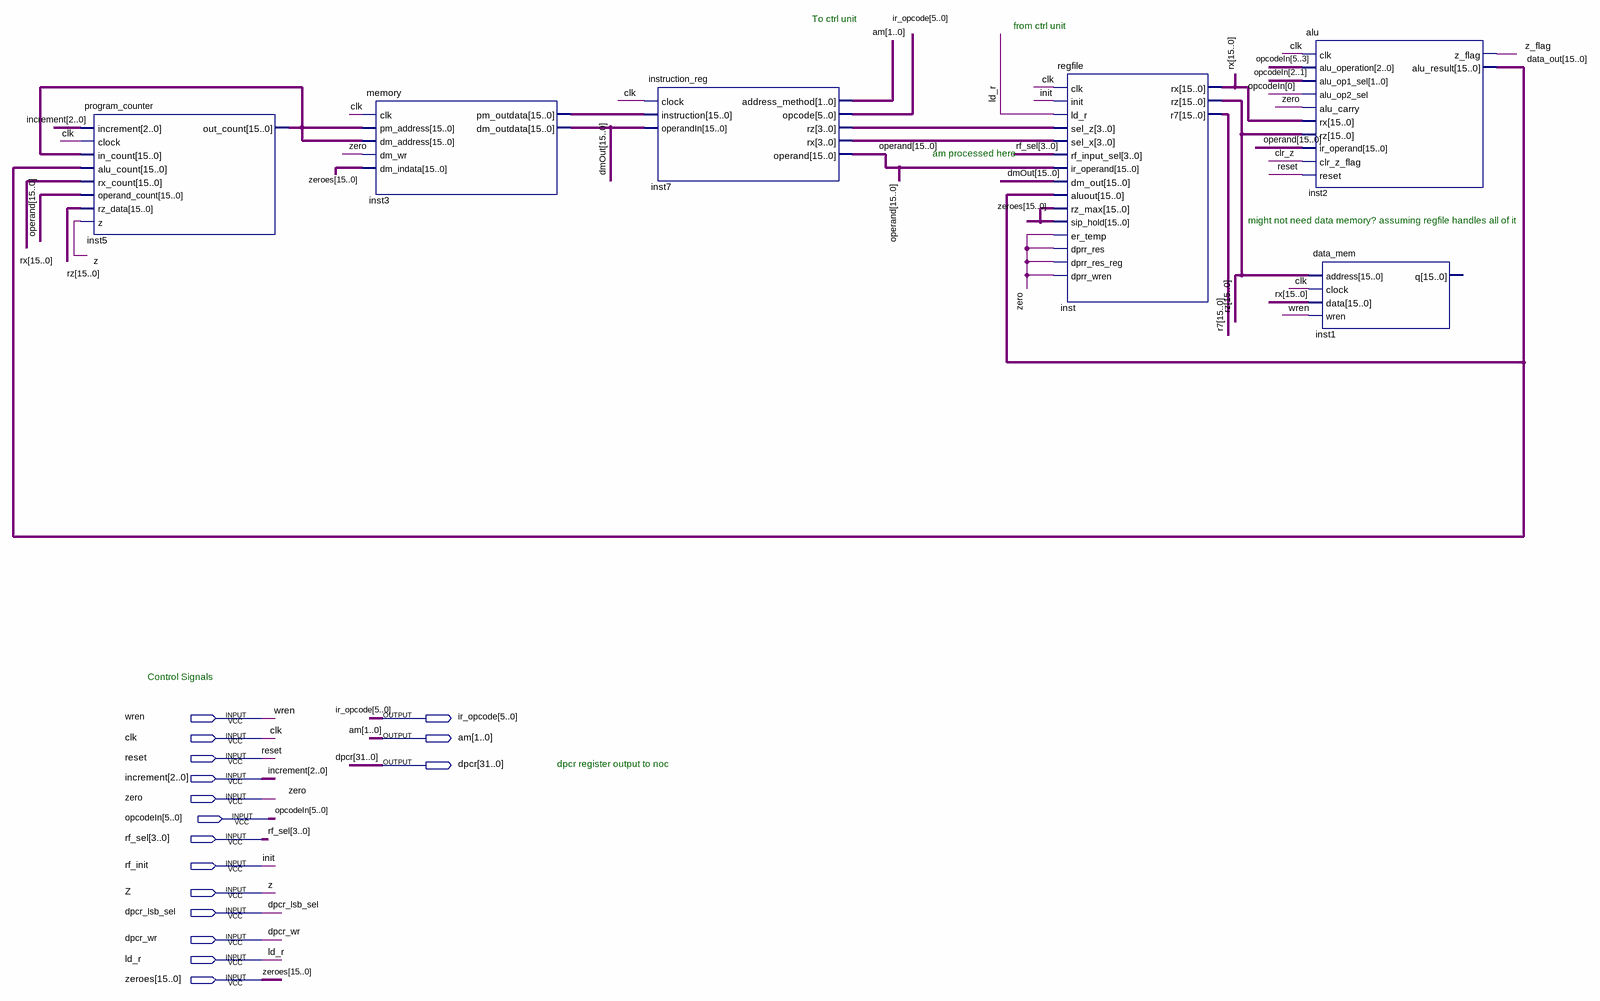
[diagram p0: schematic sheet]
// Quartus schematic datapath.bdf as structural Verilog: 6 symbols, 16 pins
module datapath (
  input  wren,
  input  clk,
  input  reset,
  input  [2:0] increment,
  input  zero,
  input  [5:0] opcodeIn,
  input  [3:0] rf_sel,
  input  rf_init,
  input  Z,
  input  dpcr_lsb_sel,
  input  dpcr_wr,
  input  ld_r,
  input  [15:0] zeroes,
  output [5:0] ir_opcode,
  output [1:0] am,
  output [31:0] dpcr
);

  wire clr_z, z_flag;
  wire [3:0] inst7_rx, inst7_rz;
  wire [15:0] data_out, dmOut, inst3_pm_outdata, inst5_out_count, operand, r7, rx, rz;

  program_counter inst5 (
    .increment(increment), .clock(clk), .in_count(inst5_out_count), .alu_count(data_out), .rx_count(rx),
    .operand_count(operand), .rz_data(rz), .z(Z), .out_count(inst5_out_count));
  memory inst3 (
    .clk(clk), .pm_address(inst5_out_count), .dm_address(inst5_out_count), .dm_wr(zero), .dm_indata(zeroes),
    .pm_outdata(inst3_pm_outdata), .dm_outdata(dmOut));
  instruction_reg inst7 (
    .clock(clk), .instruction(inst3_pm_outdata), .operandIn(dmOut), .address_method(am), .opcode(ir_opcode),
    .rz(inst7_rz), .rx(inst7_rx), .operand(operand));
  regfile inst (
    .clk(clk), .init(rf_init), .ld_r(ld_r), .sel_z(inst7_rz), .sel_x(inst7_rx), .rf_input_sel(rf_sel),
    .ir_operand(operand), .dm_out(dmOut), .aluout(data_out), .rz_max(zeroes), .sip_hold(zeroes),
    .er_temp(zero), .dprr_res(zero), .dprr_res_reg(zero), .dprr_wren(zero), .rx(rx), .rz(rz), .r7(r7));
  alu inst2 (
    .clk(clk), .alu_operation(opcodeIn[5:3]), .alu_op1_sel(opcodeIn[2:1]), .alu_op2_sel(opcodeIn[0]),
    .alu_carry(zero), .rx(rx), .rz(rz), .ir_operand(operand), .clr_z_flag(clr_z), .reset(reset),
    .z_flag(z_flag), .alu_result(data_out));
  data_mem inst1 (.address(rz), .clock(clk), .data(rx), .wren(wren));  // open: q

  // Other names for the same wires on the sheet: init = rf_init

  // Notes on the sheet:
  //   To ctrl unit
  //   from ctrl unit
  //   am processed here
  //   might not need data memory? assuming regfile handles all of it 
  //   Control Signals
  //   dpcr register output to noc
endmodule
